# EAGLE design Steering Wheel Passthrough (EAGLE 7.2.0)
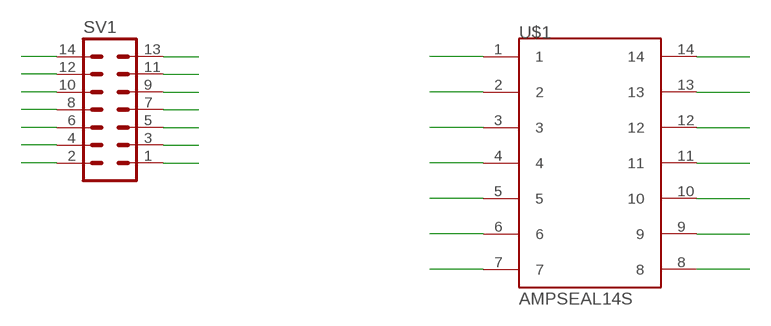
[diagram p0: schematic, sheet 1]

## Parts
SV1  MA07-2  [MA07-2]
U$1  AMPSEAL14S  [AMPSEAL_14_T]

## Nets
1: SV1.1 U$1.1
2: SV1.2 U$1.2
3: SV1.3 U$1.3
4: SV1.4 U$1.4
5: SV1.5 U$1.5
6: SV1.6 U$1.6
7: SV1.7 U$1.7
8: SV1.8 U$1.8
9: SV1.9 U$1.9
10: SV1.10 U$1.10
11: SV1.11 U$1.11
12: SV1.12 U$1.12
13: SV1.13 U$1.13
14: SV1.14 U$1.14

## Library data of the parts
SV1 = con-lstb:MA07-2: PIN HEADER; OC_FARNELL: unknown; OC_NEWARK: unknown
U$1 = AMPSEAL 14:AMPSEAL14S

## Board
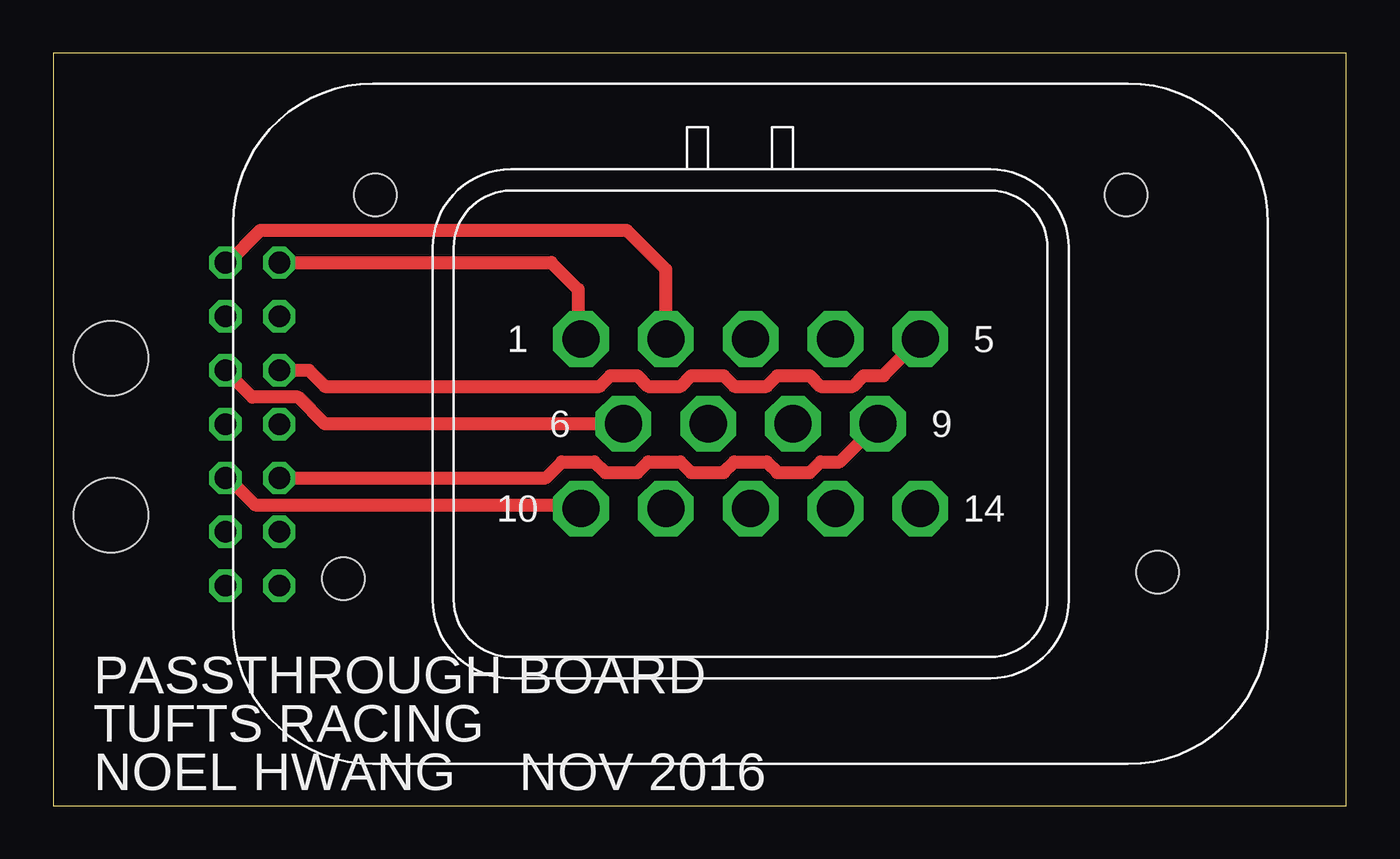
[diagram p1: board, top side]
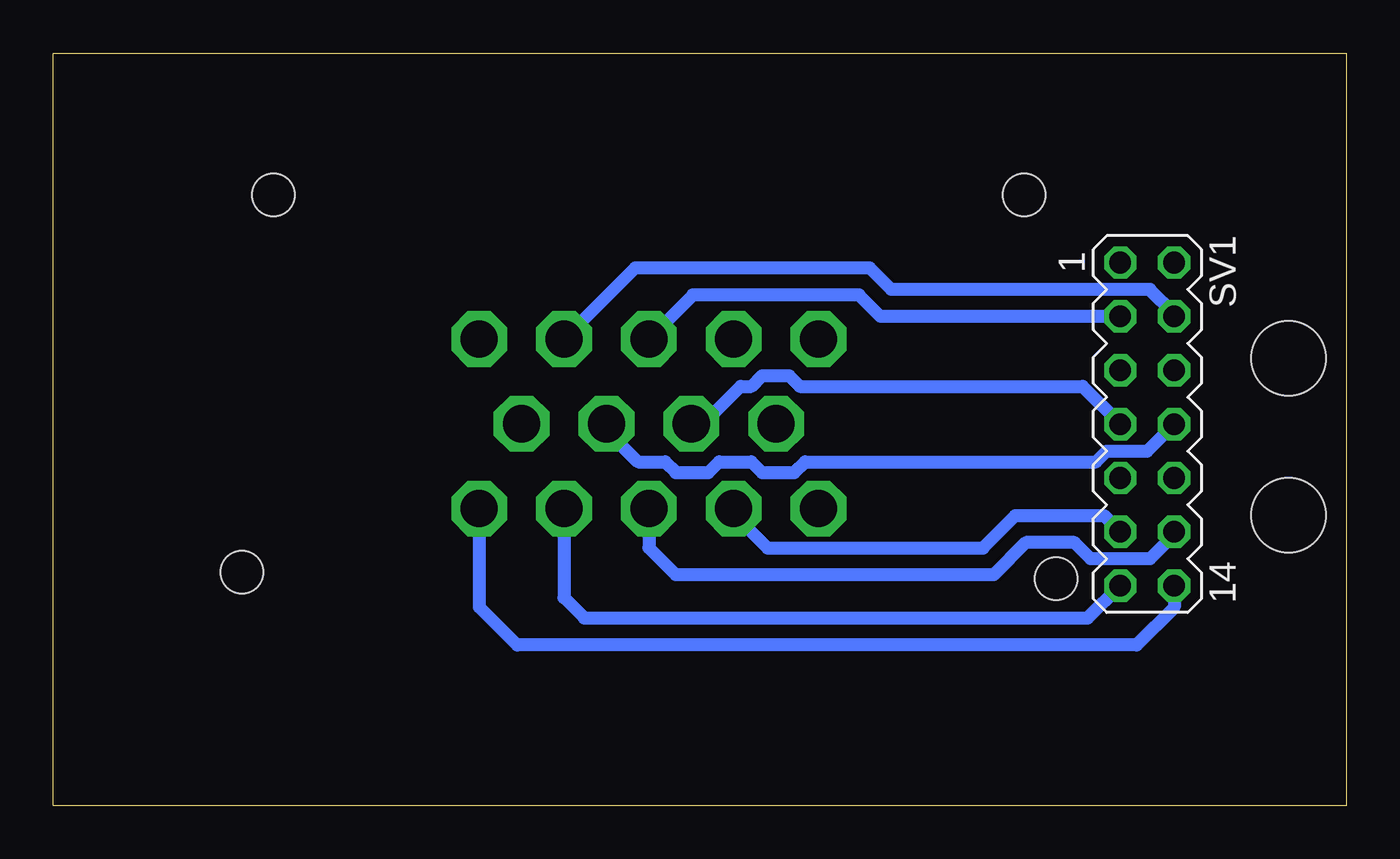
[diagram p2: board, bottom side, seen from below]

Size 61 x 35.5 mm. Coordinates in mm from the lower left corner, seen from the top.
Outline: 0,0 61,0 61,35.5 0,35.5 0,0
Copper layers (1*16): Top 0.035mm / dielectric 1.5mm / Bottom 0.035mm
Design rules "default": minimum track width 10mil, minimum drill 24mil, track to track 8mil, track to pad 8mil, pad to pad 8mil, via to via 8mil, smd to smd 8mil, copper to edge 40mil, drill to drill 8mil, minimum pad ring 10mil, minimum via ring 8mil, stop-mask expansion 4mil, vias tented up to drill 0mil, thermal gap 10mil
Holes 3.5 mm at 2.73,21.11 2.73,13.69

### Footprints (pad centres in the part's own frame; a part is rotated, then mirrored left to right if it is on the bottom)
MA07-2 = drill 1.016 octagon: 1 -7.62,-1.27; 2 -7.62,1.27; 3 -5.08,-1.27; 4 -5.08,1.27; 5 -2.54,-1.27; 6 -2.54,1.27; 7 0,-1.27; 8 0,1.27; 9 2.54,-1.27; 10 2.54,1.27; 11 5.08,-1.27; 12 5.08,1.27; 13 7.62,-1.27; 14 7.62,1.27
AMPSEAL_14_T = drill 1.75 octagon: 1 -8,4; 2 -4,4; 3 0,4; 4 4,4; 5 8,4; 6 -6,0; 7 -2,0; 8 2,0; 9 6,0; 10 -8,-4; 11 -4,-4; 12 0,-4; 13 4,-4; 14 8,-4 | hole 2: -17.7,10.8; 17.7,10.8; 19.2,-7; -19.2,-7.3

### Placement (x,y rotation side)
SV1  9.4,17.99 270 bottom
U$1  32.9,18.01 0 top

### Tracks (layer width: path | path; a pad name or v marks a point on that pad's centre or on a via)
1
  Top 0.61: SV1.1 23.49,25.61 24.76,24.34 24.76,22.15 U$1.1
2
  Top 0.61: SV1.2 8.25,25.61 9.78,27.14 27.05,27.14 28.9,25.29 U$1.2
3
  Bottom 0.61: SV1.3 21.97,23.07 22.99,24.09 30.82,24.09 U$1.3
4
  Bottom 0.61: SV1.4 8.13,23.2 9.27,24.34 21.46,24.34 22.48,25.36 33.55,25.36 U$1.4
5
  Top 0.61: SV1.5 12.06,20.53 12.83,19.77 25.78,19.77 26.29,20.28 27.56,20.28 28.07,19.77 29.59,19.77 30.1,20.28 31.62,20.28 32.13,19.77 33.65,19.77 34.16,20.28 35.69,20.28 36.19,19.77 37.72,19.77 38.23,20.28 39.17,20.28 U$1.5
6
  Top 0.61: U$1.6 12.81,18.01 11.56,19.26 9.4,19.26 SV1.6
7
  Bottom 0.61: U$1.7 30.34,18.01 28.57,19.77 28.07,19.77 27.56,20.28 26.29,20.28 25.78,19.77 12.45,19.77 SV1.7
8
  Bottom 0.61: U$1.8 34.9,17.72 33.4,16.22 32.13,16.22 31.62,15.71 30.1,15.71 29.59,16.22 28.07,16.22 27.56,15.71 26.03,15.71 25.53,16.22 11.81,16.22 11.3,16.72 9.4,16.72 SV1.8
9
  Top 0.61: SV1.9 23.24,15.45 24,16.22 25.53,16.22 26.03,15.71 27.56,15.71 28.07,16.22 29.59,16.22 30.1,15.71 31.62,15.71 32.13,16.22 33.65,16.22 34.16,15.71 35.69,15.71 36.19,16.22 37.11,16.22 U$1.9
10
  Top 0.61: SV1.10 8.25,15.45 9.52,14.18 24.73,14.18 U$1.10
11
  Bottom 0.61: U$1.11 28.9,13.75 27.3,12.15 17.14,12.15 15.62,13.68 11.43,13.68 SV1.11
12
  Bottom 0.61: SV1.12 8.13,12.79 9.27,11.64 12.06,11.64 12.83,12.41 15.11,12.41 16.64,10.88 31.62,10.88 32.9,12.16 U$1.12
13
  Bottom 0.61: U$1.13 36.9,9.81 35.94,8.85 12.21,8.85 SV1.13
14
  Bottom 0.61: SV1.14 8.13,9.36 9.9,7.58 39.11,7.58 40.9,9.37 U$1.14

### Text on the board
tNames: PASSTHROUGH BOARD | TUFTS RACING | NOEL HWANG | NOV 2016